# EAGLE design x-BIMU Serial Breakout (EAGLE 6.4)
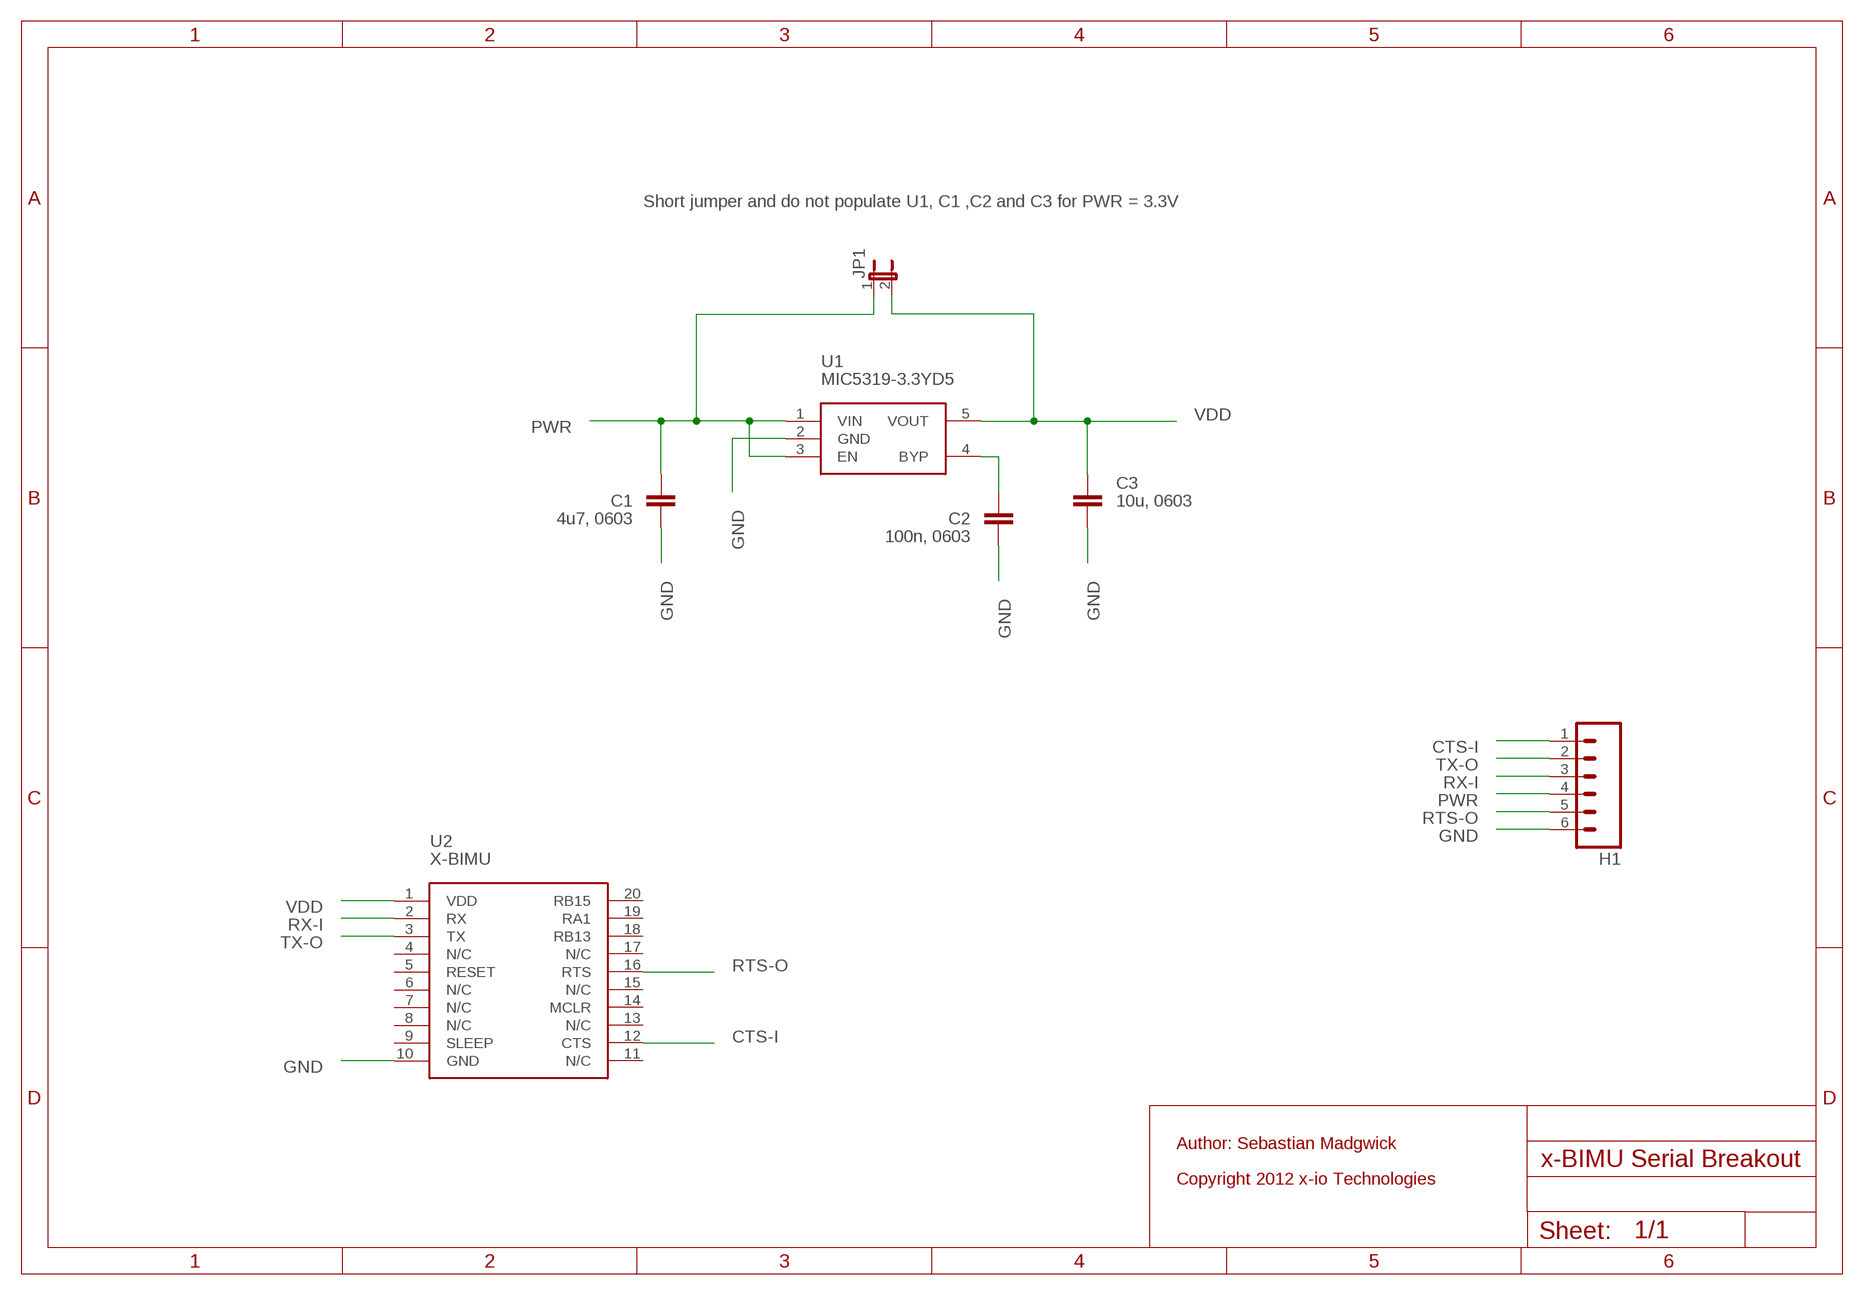
[diagram p0: schematic, sheet 1]

## Parts
C1  4u7, 0603  CAP0402-CAP  [0402-CAP]
C2  100n, 0603  CAP0402-CAP  [0402-CAP]
C3  10u, 0603  CAP0402-CAP  [0402-CAP]
H1  M06SMD  [1X06-SMD]
JP1  JUMPER-2SMD-NO  [SJ_2S-NO]
U1  MIC5319-3.3YD5  MIC5319  [SOT23-5]
U2  X-BIMU  [X-BIMU_SMD]

## Nets
CTS-I: H1.1 U2.12(CTS)
GND: C1.2 C2.2 C3.2 H1.6 U1.2(GND) U2.10(GND)
N$7: C2.1 U1.4(BYP)
PWR: C1.1 H1.4 JP1.1 U1.1(VIN) U1.3(EN)
RTS-O: H1.5 U2.16(RTS)
RX-I: H1.3 U2.2(RX)
TX-O: H1.2 U2.3(TX)
VDD: C3.1 JP1.2 U1.5(VOUT) U2.1(VDD)
Unconnected: U2.4(N/C) U2.5(RESET) U2.6(N/C) U2.7(N/C) U2.8(N/C) U2.9(SLEEP) U2.11(N/C) U2.13(N/C) U2.14(MCLR) U2.15(N/C) U2.17(N/C) U2.18(RB13) U2.19(RA1) U2.20(RB15)

## Notes on the sheet
- Short jumper and do not populate U1, C1 ,C2 and C3 for PWR = 3.3V
- Author: Sebastian Madgwick
- Copyright 2012 x-io Technologies

## Library data of the parts
C1-C3 = SparkFun:CAP: Capacitor Standard 0603 ceramic capacitor, and 0.1" leaded capacitor.
H1 = SparkFun:M06: Header 6 Standard 6-pin 0.1" header. Use with straight break away headers (SKU : PRT-00116), right angle break away headers (PRT-00553), swiss pins (PRT-00743), machine pins (PRT-00117), and female headers (PRT-00115). Molex polarized connector foot print use with SKU : PRT-08094 with associated crimp pins and housings. NOTES ON THE VARIANTS LOCK and LOCK_LONGPADS... This footprint was designed to help hold the alignment of a through-hole component (i.e. 6-pin header) while soldering it into place. You may notice that each hole has been shifted either up or down by 0.005 of an inch from it's more standard position (which is a perfectly straight line). This slight alteration caused the pins (the squares in the middle) to touch the edges of the holes. Because they are alternating, it causes a "brace" to hold the component in place. 0.005 has proven to be the perfect amount of "off-center" position when using our standard breakaway headers. Although looks a little odd when you look at the bare footprint, once you have a header in there, the alteration is very hard to notice. Also, if you push a header all the way into place, it is covered up entirely on the bottom side. This idea of altering the position of holes to aid alignment will be further integrated into the Sparkfun Library for other footprints. It can help hold any component with 3 or more connection pins.
JP1 = SparkFun:JUMPER-2: Jumper Basic 0.1" spaced jumper. Use with breakaway headers.
U1 = x-io:MIC5319
U2 = x-io:X-BIMU

## Board
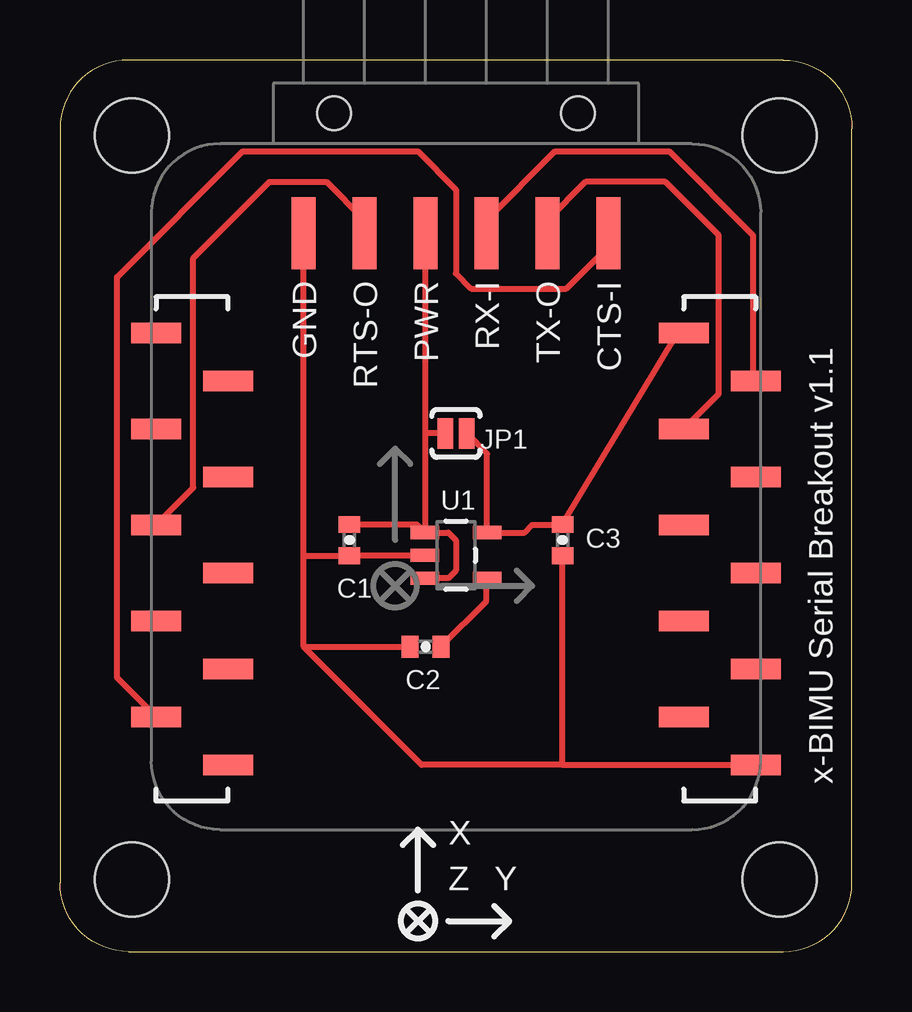
[diagram p1: board, top side]

Size 33.02 x 37.15 mm. Coordinates in mm from the lower left corner, seen from the top.
Outline: 2.86,0 30.16,0 arc90 33.02,2.86 33.02,34.29 arc90 30.16,37.15 2.86,37.15 arc90 0,34.29 0,2.86 arc90 2.86,0
Copper layers (1*16): Top 0.035mm / dielectric 1.5mm / Bottom 0.035mm
Design rules "default *": minimum track width 0.15mm, minimum drill 0.3mm, track to track 0.15mm, track to pad 0.15mm, pad to pad 0.15mm, via to via 0.15mm, smd to smd 0.15mm, copper to edge 0.2mm, drill to drill 0.15mm, minimum pad ring 10mil, minimum via ring 8mil, stop-mask expansion 4mil, vias tented up to drill 1mm, thermal gap 0.195mm
Holes 3.1 mm at 3,34 30,34 3,3 30,3

### Footprints (pad centres in the part's own frame; a part is rotated, then mirrored left to right if it is on the bottom)
0402-CAP = smd 0.7 x 0.9: 1 -0.65,0; 2 0.65,0
1X06-SMD = smd 1 x 3: 1 -6.35,5; 2 -3.81,5; 3 -1.27,5; 4 1.27,5; 5 3.81,5; 6 6.35,5 | hole 1.4: -5.08,0; 5.08,0
SJ_2S-NO = smd 0.635 x 1.27: 1 -0.45,0; 2 0.45,0
SOT23-5 = smd 0.55 x 1.2: 1 -0.95,-1.3; 2 0,-1.3; 3 0.95,-1.3; 4 0.95,1.3; 5 -0.95,1.3
X-BIMU_SMD = smd 2.1 x 0.85: 1 9.5,8; 2 12.5,6; 3 9.5,4; 4 12.5,2; 5 9.5,0; 6 12.5,-2; 7 9.5,-4; 8 12.5,-6; 9 9.5,-8; 10 12.5,-10; 11 -9.5,-10; 12 -12.5,-8; 13 -9.5,-6; 14 -12.5,-4; 15 -9.5,-2; 16 -12.5,0; 17 -9.5,2; 18 -12.5,4; 19 -9.5,6; 20 -12.5,8

### Placement (x,y rotation side)
C1  12.06,17.14 270 top
C2  15.24,12.7 180 top
C3  20.95,17.14 270 top
H1  16.51,34.92 180 top
JP1  16.51,21.59 0 top
U1  16.51,16.51 270 top
U2  16.51,17.78 0 top
U$1  [X-IO_TECHNOLOGIES_LOGO_10MM_BOTTOM]  26.67,3.81 0 bottom
U$2  [OSHW_LOGO_6MM_BOTTOM]  7.94,3.81 0 top

### Tracks (layer width: path | path; a pad name or v marks a point on that pad's centre or on a via)
CTS-I
  Top 0.254: H1.1 22.86,29.37 21.11,27.62 17.14,27.62 16.51,28.26 16.51,31.75 14.92,33.34 7.62,33.34 2.38,28.1 2.38,11.41 U2.12
GND
  Top 0.254: 10.16,16.51 H1.6 | 20.95,7.78 U2.10 | 10.16,12.7 10.16,16.51 | 10.16,16.51 10.18,16.5 C1.2 12.08,16.51 U1.2 | 10.16,12.7 C2.2 | 20.95,7.78 C3.2 | 20.95,7.78 15.08,7.78 10.16,12.7
N$7
  Top 0.254: C2.1 15.89,12.71 17.78,14.61 17.78,15.53 U1.4
PWR
  Top 0.254: U1.3 16.2,15.56 16.51,15.88 16.51,17.14 16.2,17.46 U1.1 | C1.1 14.88,17.8 U1.1 | 15.24,21.59 15.24,17.49 U1.1 | 15.24,21.59 H1.4 | JP1.1 15.24,21.59
RTS-O
  Top 0.254: U2.16 5.56,19.33 5.56,28.89 8.73,32.07 11.11,32.07 12.7,30.48 H1.5
RX-I
  Top 0.254: H1.3 17.78,30.48 20.64,33.34 25.4,33.34 28.89,29.84 28.89,23.9 U2.2
TX-O
  Top 0.254: H1.2 20.32,30.48 21.91,32.07 25.24,32.07 27.46,29.84 27.46,23.23 U2.3
VDD
  Top 0.254: U2.1 25.77,25.78 C3.1 19.68,17.78 19.36,17.46 U1.5 17.81,20.74 JP1.2

### Text on the board
_tsilk: GND | RTS-O | PWR | RX-I | TX-O | CTS-I | x-BIMU Serial Breakout v1.1 | X | Z | Y
_bsilk: GND | RTS-O | PWR | RX-I | TX-O | CTS-I | X | Z | Y | x-BIMU Serial Breakout v1.1